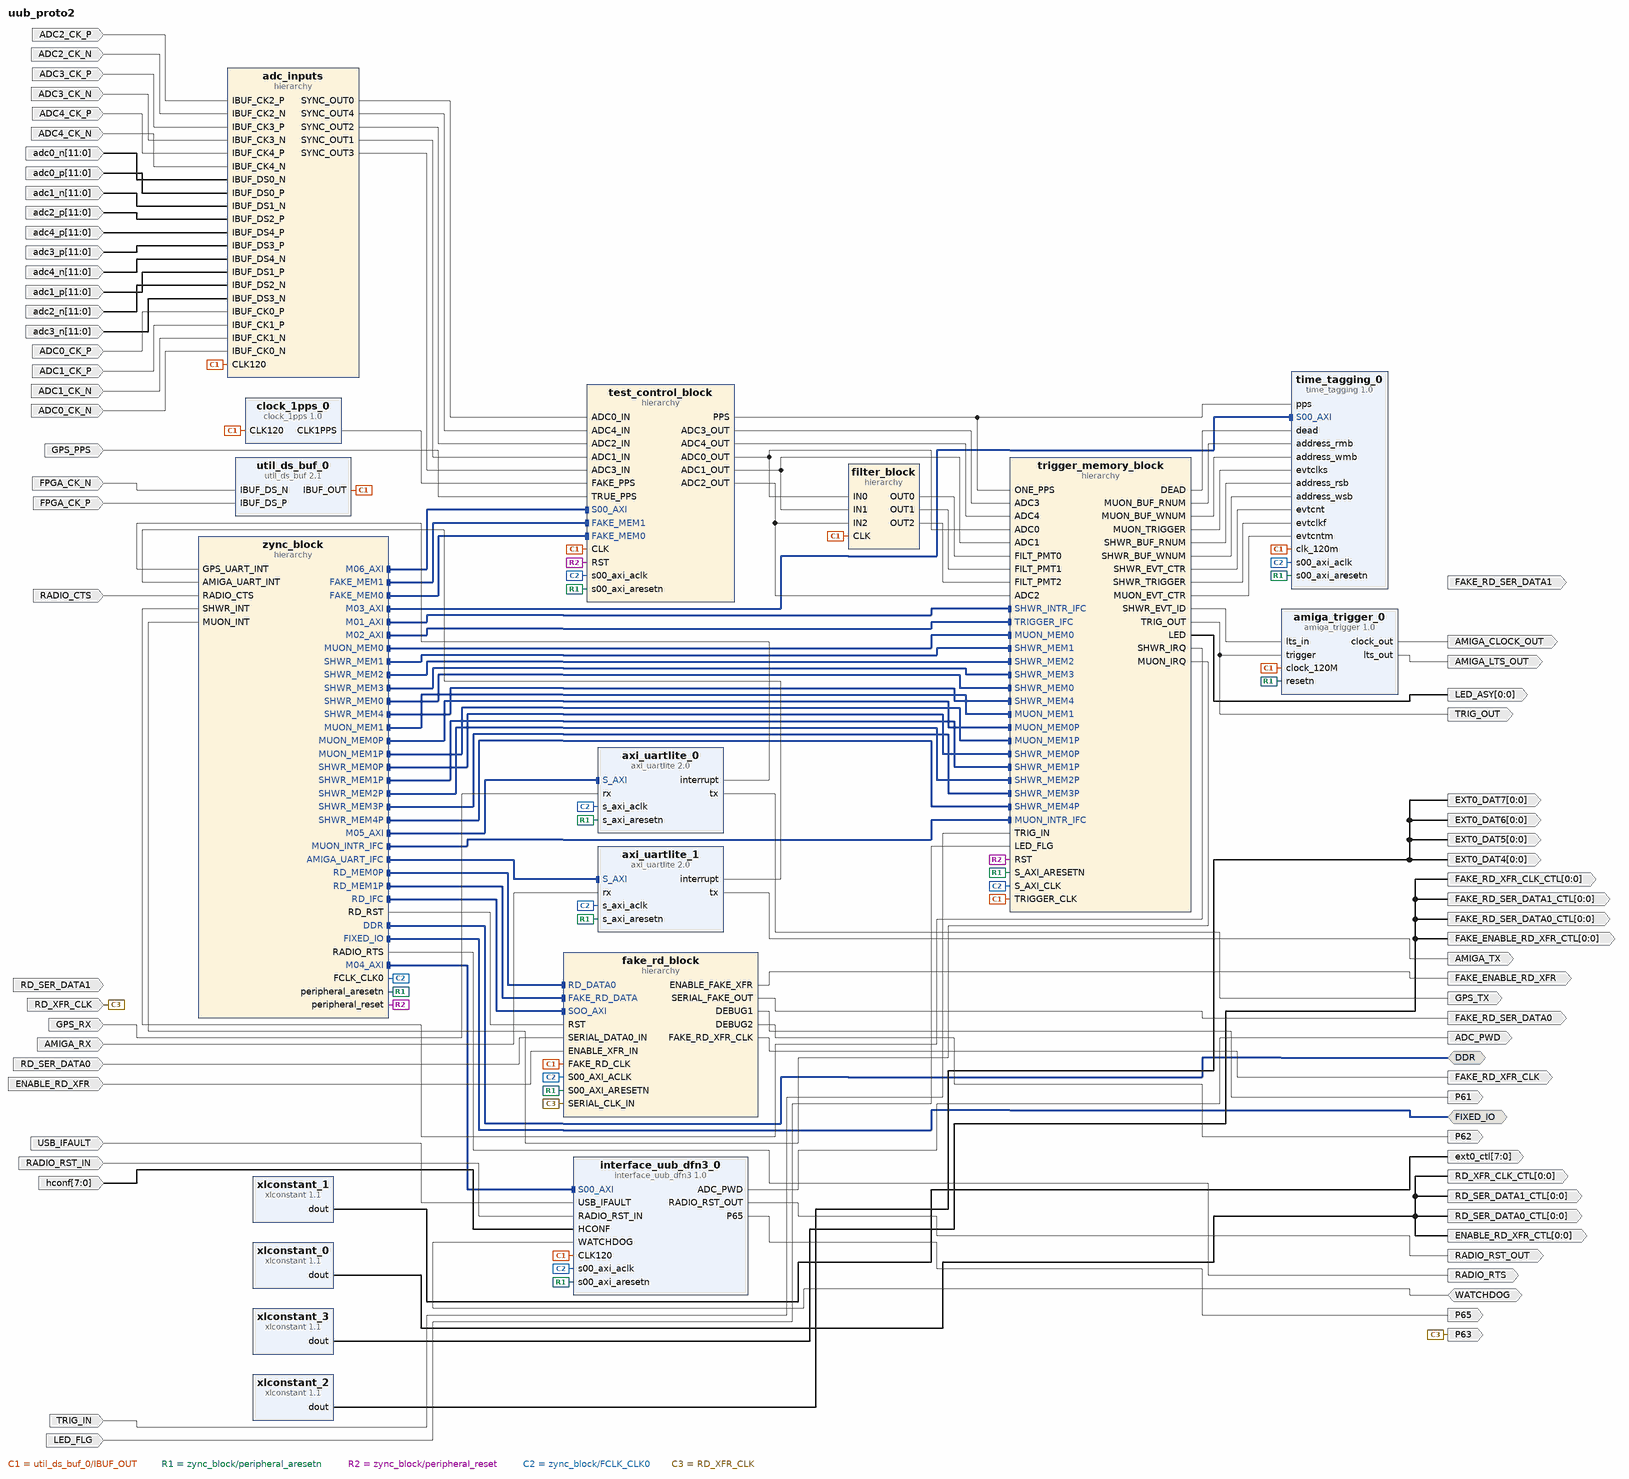
[diagram p0: block diagram of the top level]
# Vivado block design uub_proto2, Vivado 2015.2
create_bd_design uub_proto2

create_bd_intf_port -mode Master -vlnv xilinx.com:interface:ddrx_rtl:1.0 DDR
create_bd_intf_port -mode Master -vlnv xilinx.com:display_processing_system7:fixedio_rtl:1.0 FIXED_IO
create_bd_port -dir I RD_SER_DATA1
create_bd_port -dir O FAKE_RD_SER_DATA1
create_bd_port -dir I -type clk FPGA_CK_N
set_property -dict {CONFIG.FREQ_HZ 120000000} [get_bd_ports FPGA_CK_N]
create_bd_port -dir I -type clk FPGA_CK_P
set_property -dict {CONFIG.FREQ_HZ 120000000} [get_bd_ports FPGA_CK_P]
create_bd_port -dir I RADIO_CTS
create_bd_port -dir O GPS_TX
create_bd_port -dir I GPS_RX
create_bd_port -dir O RADIO_RTS
create_bd_port -dir I -type clk ADC2_CK_P
set_property -dict {CONFIG.FREQ_HZ 120000000} [get_bd_ports ADC2_CK_P]
create_bd_port -dir I -type clk ADC2_CK_N
set_property -dict {CONFIG.FREQ_HZ 120000000} [get_bd_ports ADC2_CK_N]
create_bd_port -dir I -type clk ADC3_CK_P
set_property -dict {CONFIG.FREQ_HZ 120000000} [get_bd_ports ADC3_CK_P]
create_bd_port -dir I -type clk ADC3_CK_N
set_property -dict {CONFIG.FREQ_HZ 120000000} [get_bd_ports ADC3_CK_N]
create_bd_port -dir I -type clk ADC4_CK_P
set_property -dict {CONFIG.FREQ_HZ 120000000} [get_bd_ports ADC4_CK_P]
create_bd_port -dir I -type clk ADC4_CK_N
set_property -dict {CONFIG.FREQ_HZ 120000000} [get_bd_ports ADC4_CK_N]
create_bd_port -dir I -from 11 -to 0 adc0_n
create_bd_port -dir I -from 11 -to 0 adc0_p
create_bd_port -dir I -from 11 -to 0 -type data adc1_n
create_bd_port -dir I -from 11 -to 0 -type data adc2_p
create_bd_port -dir I -from 11 -to 0 -type data adc4_p
create_bd_port -dir I -from 11 -to 0 -type data adc3_p
create_bd_port -dir I -from 11 -to 0 -type data adc4_n
create_bd_port -dir I -from 11 -to 0 -type data adc1_p
create_bd_port -dir I -from 11 -to 0 -type data adc2_n
create_bd_port -dir I -from 11 -to 0 -type data adc3_n
create_bd_port -dir I TRIG_IN
create_bd_port -dir I -type clk ADC0_CK_P
set_property -dict {CONFIG.FREQ_HZ 120000000} [get_bd_ports ADC0_CK_P]
create_bd_port -dir I -type clk ADC1_CK_P
set_property -dict {CONFIG.FREQ_HZ 120000000} [get_bd_ports ADC1_CK_P]
create_bd_port -dir I -type clk ADC1_CK_N
set_property -dict {CONFIG.FREQ_HZ 120000000} [get_bd_ports ADC1_CK_N]
create_bd_port -dir I -type clk ADC0_CK_N
set_property -dict {CONFIG.FREQ_HZ 120000000} [get_bd_ports ADC0_CK_N]
create_bd_port -dir I USB_IFAULT
create_bd_port -dir I RADIO_RST_IN
create_bd_port -dir I -from 7 -to 0 hconf
create_bd_port -dir O -from 0 -to 0 LED_ASY
create_bd_port -dir I LED_FLG
create_bd_port -dir O RADIO_RST_OUT
create_bd_port -dir I GPS_PPS
create_bd_port -dir O TRIG_OUT
create_bd_port -dir IO WATCHDOG
create_bd_port -dir O ADC_PWD
create_bd_port -dir O P65
create_bd_port -dir O -from 7 -to 0 ext0_ctl
create_bd_port -dir O AMIGA_CLOCK_OUT
create_bd_port -dir O AMIGA_LTS_OUT
create_bd_port -dir O AMIGA_TX
create_bd_port -dir I AMIGA_RX
create_bd_port -dir I RD_SER_DATA0
create_bd_port -dir I ENABLE_RD_XFR
create_bd_port -dir O FAKE_ENABLE_RD_XFR
create_bd_port -dir O -from 0 -to 0 ENABLE_RD_XFR_CTL
create_bd_port -dir O -from 0 -to 0 RD_SER_DATA1_CTL
create_bd_port -dir O -from 0 -to 0 RD_SER_DATA0_CTL
create_bd_port -dir O -from 0 -to 0 RD_XFR_CLK_CTL
create_bd_port -dir O -from 0 -to 0 FAKE_RD_XFR_CLK_CTL
create_bd_port -dir O -from 0 -to 0 FAKE_ENABLE_RD_XFR_CTL
create_bd_port -dir O -from 0 -to 0 FAKE_RD_SER_DATA0_CTL
create_bd_port -dir O -from 0 -to 0 FAKE_RD_SER_DATA1_CTL
create_bd_port -dir O FAKE_RD_SER_DATA0
create_bd_port -dir O -from 0 -to 0 EXT0_DAT7
create_bd_port -dir O -from 0 -to 0 EXT0_DAT6
create_bd_port -dir O -from 0 -to 0 EXT0_DAT4
create_bd_port -dir O -from 0 -to 0 EXT0_DAT5
create_bd_port -dir I -type clk RD_XFR_CLK
create_bd_port -dir O P63
create_bd_port -dir O P61
create_bd_port -dir O P62
create_bd_port -dir O FAKE_RD_XFR_CLK

create_bd_cell -type hier zync_block
create_bd_cell -type ip -vlnv xilinx.com:ip:axi_uartlite:2.0 axi_uartlite_0
create_bd_cell -type ip -vlnv auger.org:dfnitz:clock_1pps:1.0 clock_1pps_0
create_bd_cell -type ip -vlnv xilinx.com:ip:util_ds_buf:2.1 util_ds_buf_0
set_property -dict {CONFIG.C_BUF_TYPE IBUFDS} [get_bd_cells util_ds_buf_0]
create_bd_cell -type hier adc_inputs
create_bd_cell -type hier trigger_memory_block
create_bd_cell -type ip -vlnv xilinx.com:ip:xlconstant:1.1 xlconstant_0
set_property -dict {CONFIG.CONST_WIDTH 1 CONFIG.CONST_VAL 0} [get_bd_cells xlconstant_0]
create_bd_cell -type hier filter_block
create_bd_cell -type ip -vlnv xilinx.com:user:time_tagging:1.0 time_tagging_0
create_bd_cell -type ip -vlnv auger.org:auger:interface_uub_dfn3:1.0 interface_uub_dfn3_0
create_bd_cell -type ip -vlnv user.org:user:amiga_trigger:1.0 amiga_trigger_0
create_bd_cell -type ip -vlnv xilinx.com:ip:xlconstant:1.1 xlconstant_1
set_property -dict {CONFIG.CONST_WIDTH 8 CONFIG.CONST_VAL 251} [get_bd_cells xlconstant_1]
create_bd_cell -type ip -vlnv xilinx.com:ip:axi_uartlite:2.0 axi_uartlite_1
create_bd_cell -type ip -vlnv xilinx.com:ip:xlconstant:1.1 xlconstant_2
set_property -dict {CONFIG.CONST_WIDTH 1 CONFIG.CONST_VAL 0} [get_bd_cells xlconstant_2]
create_bd_cell -type hier test_control_block
create_bd_cell -type hier fake_rd_block
create_bd_cell -type ip -vlnv xilinx.com:ip:xlconstant:1.1 xlconstant_3
set_property -dict {CONFIG.CONST_WIDTH 1 CONFIG.CONST_VAL 1} [get_bd_cells xlconstant_3]

# ---- hierarchy /zync_block ----
current_bd_instance /zync_block
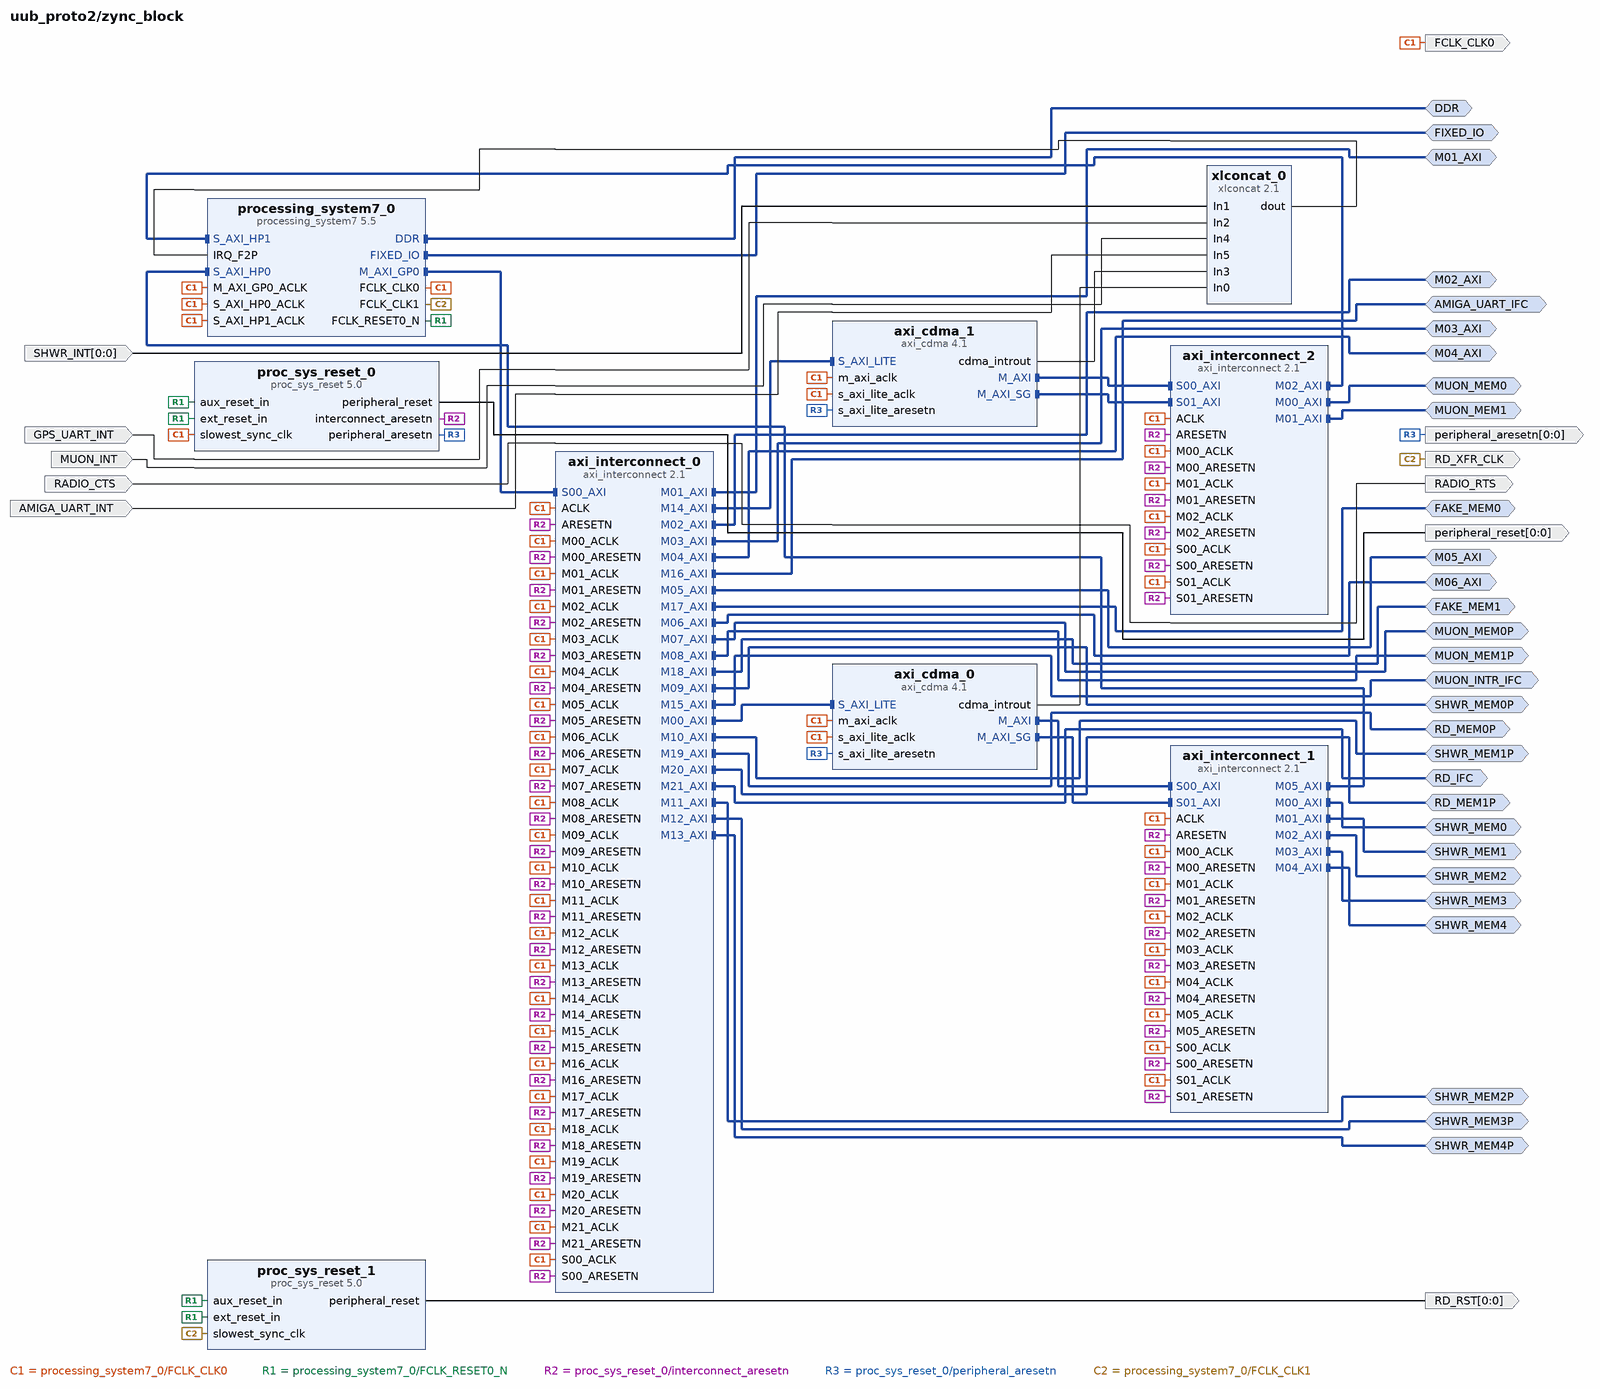
[diagram p1: block diagram inside /zync_block]
create_bd_intf_pin -mode Master -vlnv xilinx.com:interface:ddrx_rtl:1.0 DDR
create_bd_intf_pin -mode Master -vlnv xilinx.com:display_processing_system7:fixedio_rtl:1.0 FIXED_IO
create_bd_intf_pin -mode Master -vlnv xilinx.com:interface:aximm_rtl:1.0 M01_AXI
create_bd_intf_pin -mode Master -vlnv xilinx.com:interface:aximm_rtl:1.0 MUON_MEM0
create_bd_intf_pin -mode Master -vlnv xilinx.com:interface:aximm_rtl:1.0 M02_AXI
create_bd_intf_pin -mode Master -vlnv xilinx.com:interface:aximm_rtl:1.0 SHWR_MEM0
create_bd_intf_pin -mode Master -vlnv xilinx.com:interface:aximm_rtl:1.0 M03_AXI
create_bd_intf_pin -mode Master -vlnv xilinx.com:interface:aximm_rtl:1.0 SHWR_MEM1
create_bd_intf_pin -mode Master -vlnv xilinx.com:interface:aximm_rtl:1.0 M04_AXI
create_bd_intf_pin -mode Master -vlnv xilinx.com:interface:aximm_rtl:1.0 SHWR_MEM2
create_bd_intf_pin -mode Master -vlnv xilinx.com:interface:aximm_rtl:1.0 M05_AXI
create_bd_intf_pin -mode Master -vlnv xilinx.com:interface:aximm_rtl:1.0 SHWR_MEM3
create_bd_intf_pin -mode Master -vlnv xilinx.com:interface:aximm_rtl:1.0 M06_AXI
create_bd_intf_pin -mode Master -vlnv xilinx.com:interface:aximm_rtl:1.0 SHWR_MEM4
create_bd_intf_pin -mode Master -vlnv xilinx.com:interface:aximm_rtl:1.0 MUON_MEM1
create_bd_intf_pin -mode Master -vlnv xilinx.com:interface:aximm_rtl:1.0 MUON_MEM0P
create_bd_intf_pin -mode Master -vlnv xilinx.com:interface:aximm_rtl:1.0 MUON_MEM1P
create_bd_intf_pin -mode Master -vlnv xilinx.com:interface:aximm_rtl:1.0 SHWR_MEM0P
create_bd_intf_pin -mode Master -vlnv xilinx.com:interface:aximm_rtl:1.0 SHWR_MEM1P
create_bd_intf_pin -mode Master -vlnv xilinx.com:interface:aximm_rtl:1.0 SHWR_MEM2P
create_bd_intf_pin -mode Master -vlnv xilinx.com:interface:aximm_rtl:1.0 SHWR_MEM3P
create_bd_intf_pin -mode Master -vlnv xilinx.com:interface:aximm_rtl:1.0 SHWR_MEM4P
create_bd_intf_pin -mode Master -vlnv xilinx.com:interface:aximm_rtl:1.0 MUON_INTR_IFC
create_bd_intf_pin -mode Master -vlnv xilinx.com:interface:aximm_rtl:1.0 AMIGA_UART_IFC
create_bd_intf_pin -mode Master -vlnv xilinx.com:interface:aximm_rtl:1.0 FAKE_MEM0
create_bd_intf_pin -mode Master -vlnv xilinx.com:interface:aximm_rtl:1.0 FAKE_MEM1
create_bd_intf_pin -mode Master -vlnv xilinx.com:interface:aximm_rtl:1.0 RD_MEM0P
create_bd_intf_pin -mode Master -vlnv xilinx.com:interface:aximm_rtl:1.0 RD_MEM1P
create_bd_intf_pin -mode Master -vlnv xilinx.com:interface:aximm_rtl:1.0 RD_IFC
create_bd_pin -dir O -type clk FCLK_CLK0
create_bd_pin -dir I -from 0 -to 0 SHWR_INT
create_bd_pin -dir I RADIO_CTS
create_bd_pin -dir O RADIO_RTS
create_bd_pin -dir O -from 0 -to 0 -type rst peripheral_aresetn
create_bd_pin -dir O -from 0 -to 0 -type rst peripheral_reset
create_bd_pin -dir I GPS_UART_INT
create_bd_pin -dir I MUON_INT
create_bd_pin -dir I AMIGA_UART_INT
create_bd_pin -dir O RD_XFR_CLK
create_bd_pin -dir O -from 0 -to 0 RD_RST

create_bd_cell -type ip -vlnv xilinx.com:ip:axi_interconnect:2.1 axi_interconnect_1
set_property -dict {CONFIG.NUM_SI 2 CONFIG.NUM_MI 6 CONFIG.ENABLE_ADVANCED_OPTIONS 0} [get_bd_cells axi_interconnect_1]
create_bd_cell -type ip -vlnv xilinx.com:ip:proc_sys_reset:5.0 proc_sys_reset_0
create_bd_cell -type ip -vlnv xilinx.com:ip:xlconcat:2.1 xlconcat_0
set_property -dict {CONFIG.NUM_PORTS 6} [get_bd_cells xlconcat_0]
create_bd_cell -type ip -vlnv xilinx.com:ip:axi_cdma:4.1 axi_cdma_0
create_bd_cell -type ip -vlnv xilinx.com:ip:axi_interconnect:2.1 axi_interconnect_0
set_property -dict {CONFIG.NUM_MI 22} [get_bd_cells axi_interconnect_0]
create_bd_cell -type ip -vlnv xilinx.com:ip:axi_interconnect:2.1 axi_interconnect_2
set_property -dict {CONFIG.NUM_SI 2 CONFIG.NUM_MI 3 CONFIG.ENABLE_ADVANCED_OPTIONS 0} [get_bd_cells axi_interconnect_2]
create_bd_cell -type ip -vlnv xilinx.com:ip:axi_cdma:4.1 axi_cdma_1
create_bd_cell -type ip -vlnv xilinx.com:ip:processing_system7:5.5 processing_system7_0
set_property -dict [list \
  CONFIG.PCW_UIPARAM_DDR_FREQ_MHZ 400 \
  CONFIG.PCW_CRYSTAL_PERIPHERAL_FREQMHZ 50 \
  CONFIG.PCW_APU_PERIPHERAL_FREQMHZ 333.5 \
  CONFIG.PCW_QSPI_PERIPHERAL_FREQMHZ 60 \
  CONFIG.PCW_SPI_PERIPHERAL_FREQMHZ 100 \
  CONFIG.PCW_FPGA0_PERIPHERAL_FREQMHZ 50 \
  CONFIG.PCW_FPGA1_PERIPHERAL_FREQMHZ 30 \
  CONFIG.PCW_USE_S_AXI_HP0 1 \
  CONFIG.PCW_USE_S_AXI_HP1 1 \
  CONFIG.PCW_USE_FABRIC_INTERRUPT 1 \
  CONFIG.PCW_EN_CLK1_PORT 1 \
  CONFIG.PCW_IRQ_F2P_INTR 1 \
  CONFIG.PCW_PRESET_BANK1_VOLTAGE {LVCMOS 1.8V} \
  CONFIG.PCW_UIPARAM_DDR_MEMORY_TYPE {LPDDR 2} \
  CONFIG.PCW_UIPARAM_DDR_PARTNO Custom \
  CONFIG.PCW_QSPI_PERIPHERAL_ENABLE 1 \
  CONFIG.PCW_QSPI_GRP_SINGLE_SS_ENABLE 0 \
  CONFIG.PCW_QSPI_GRP_SS1_ENABLE 1 \
  CONFIG.PCW_ENET0_PERIPHERAL_ENABLE 1 \
  CONFIG.PCW_ENET0_ENET0_IO {MIO 16 .. 27} \
  CONFIG.PCW_ENET0_GRP_MDIO_ENABLE 1 \
  CONFIG.PCW_ENET0_RESET_ENABLE 1 \
  CONFIG.PCW_ENET0_RESET_IO {MIO 50} \
  CONFIG.PCW_UART0_PERIPHERAL_ENABLE 1 \
  CONFIG.PCW_UART0_UART0_IO {MIO 46 .. 47} \
  CONFIG.PCW_UART0_GRP_FULL_ENABLE 1 \
  CONFIG.PCW_UART1_PERIPHERAL_ENABLE 1 \
  CONFIG.PCW_UART1_UART1_IO {MIO 8 .. 9} \
  CONFIG.PCW_SPI0_PERIPHERAL_ENABLE 1 \
  CONFIG.PCW_SPI0_SPI0_IO {MIO 40 .. 45} \
  CONFIG.PCW_SPI0_GRP_SS1_ENABLE 1 \
  CONFIG.PCW_SPI0_GRP_SS2_ENABLE 1 \
  CONFIG.PCW_SPI1_PERIPHERAL_ENABLE 1 \
  CONFIG.PCW_SPI1_SPI1_IO {MIO 10 .. 15} \
  CONFIG.PCW_USB0_PERIPHERAL_ENABLE 1 \
  CONFIG.PCW_USB0_RESET_ENABLE 1 \
  CONFIG.PCW_USB0_RESET_IO {MIO 51} \
  CONFIG.PCW_I2C0_PERIPHERAL_ENABLE 1 \
  CONFIG.PCW_I2C0_I2C0_IO {MIO 14 .. 15} \
  CONFIG.PCW_I2C1_PERIPHERAL_ENABLE 1 \
  CONFIG.PCW_I2C1_I2C1_IO {MIO 48 .. 49} \
  CONFIG.PCW_GPIO_MIO_GPIO_ENABLE 1 \
  CONFIG.PCW_GPIO_MIO_GPIO_IO MIO \
] [get_bd_cells processing_system7_0]
# 23 more settings of processing_system7_0 are not shown: defaults, MIO pin electricals, DDR timing, and values the tool derives
create_bd_cell -type ip -vlnv xilinx.com:ip:proc_sys_reset:5.0 proc_sys_reset_1

# ---- hierarchy /adc_inputs ----
current_bd_instance /adc_inputs
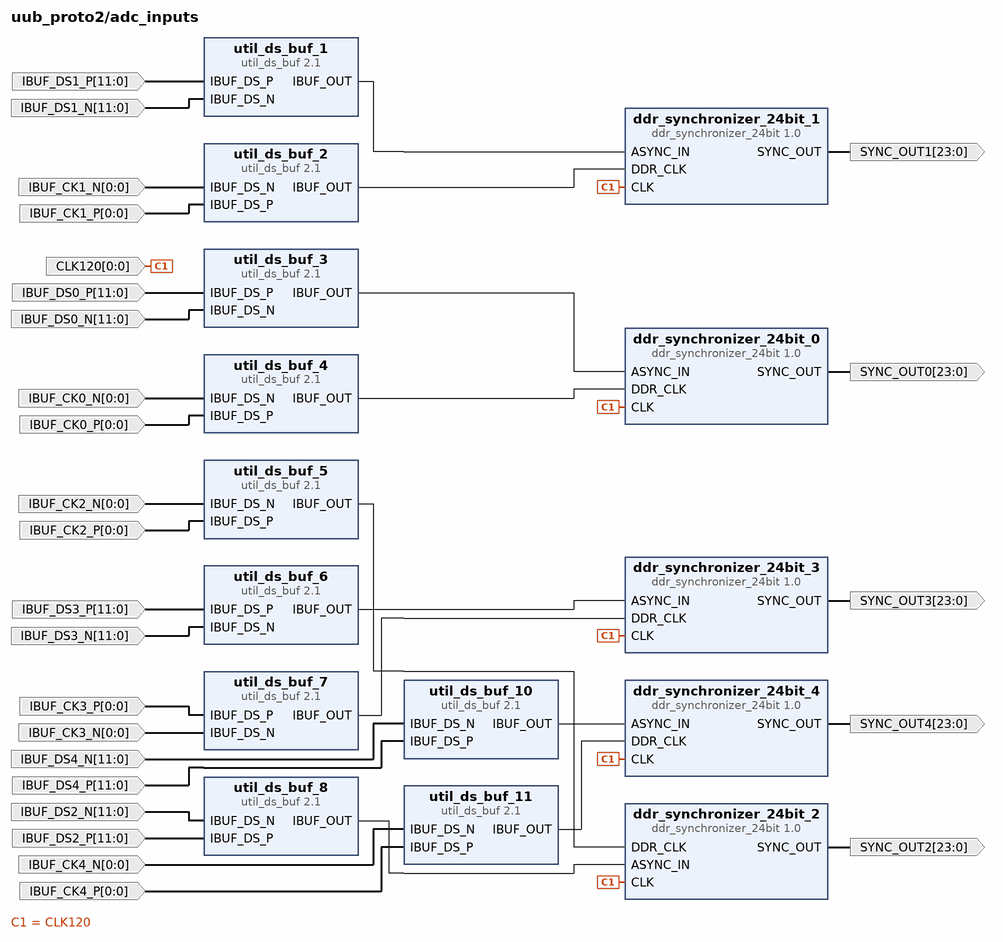
[diagram p2: block diagram inside /adc_inputs]
create_bd_pin -dir I -from 0 -to 0 -type clk CLK120
create_bd_pin -dir I -from 11 -to 0 IBUF_DS2_N
create_bd_pin -dir I -from 11 -to 0 IBUF_DS1_P
create_bd_pin -dir I -from 11 -to 0 IBUF_DS4_N
create_bd_pin -dir I -from 11 -to 0 IBUF_DS3_P
create_bd_pin -dir I -from 11 -to 0 IBUF_DS0_P
create_bd_pin -dir I -from 0 -to 0 IBUF_CK4_N
create_bd_pin -dir I -from 0 -to 0 IBUF_CK3_P
create_bd_pin -dir I -from 0 -to 0 IBUF_CK2_N
create_bd_pin -dir I -from 0 -to 0 IBUF_CK2_P
create_bd_pin -dir O -from 23 -to 0 SYNC_OUT0
create_bd_pin -dir I -from 0 -to 0 IBUF_CK1_N
create_bd_pin -dir I -from 0 -to 0 IBUF_CK4_P
create_bd_pin -dir O -from 23 -to 0 SYNC_OUT3
create_bd_pin -dir I -from 11 -to 0 IBUF_DS3_N
create_bd_pin -dir O -from 23 -to 0 SYNC_OUT1
create_bd_pin -dir I -from 11 -to 0 IBUF_DS0_N
create_bd_pin -dir I -from 0 -to 0 IBUF_CK3_N
create_bd_pin -dir O -from 23 -to 0 SYNC_OUT2
create_bd_pin -dir O -from 23 -to 0 SYNC_OUT4
create_bd_pin -dir I -from 11 -to 0 IBUF_DS2_P
create_bd_pin -dir I -from 0 -to 0 IBUF_CK0_N
create_bd_pin -dir I -from 11 -to 0 IBUF_DS1_N
create_bd_pin -dir I -from 0 -to 0 IBUF_CK1_P
create_bd_pin -dir I -from 0 -to 0 IBUF_CK0_P
create_bd_pin -dir I -from 11 -to 0 IBUF_DS4_P

create_bd_cell -type ip -vlnv xilinx.com:ip:util_ds_buf:2.1 util_ds_buf_5
create_bd_cell -type ip -vlnv xilinx.com:ip:util_ds_buf:2.1 util_ds_buf_7
create_bd_cell -type ip -vlnv xilinx.com:ip:util_ds_buf:2.1 util_ds_buf_11
create_bd_cell -type ip -vlnv xilinx.com:ip:util_ds_buf:2.1 util_ds_buf_8
set_property -dict {CONFIG.C_SIZE 12} [get_bd_cells util_ds_buf_8]
create_bd_cell -type ip -vlnv xilinx.com:ip:util_ds_buf:2.1 util_ds_buf_6
set_property -dict {CONFIG.C_SIZE 12} [get_bd_cells util_ds_buf_6]
create_bd_cell -type ip -vlnv xilinx.com:ip:util_ds_buf:2.1 util_ds_buf_10
set_property -dict {CONFIG.C_SIZE 12} [get_bd_cells util_ds_buf_10]
create_bd_cell -type ip -vlnv xilinx.com:ip:util_ds_buf:2.1 util_ds_buf_2
create_bd_cell -type ip -vlnv xilinx.com:ip:util_ds_buf:2.1 util_ds_buf_4
create_bd_cell -type ip -vlnv xilinx.com:ip:util_ds_buf:2.1 util_ds_buf_1
set_property -dict {CONFIG.C_SIZE 12} [get_bd_cells util_ds_buf_1]
create_bd_cell -type ip -vlnv xilinx.com:ip:util_ds_buf:2.1 util_ds_buf_3
set_property -dict {CONFIG.C_SIZE 12} [get_bd_cells util_ds_buf_3]
create_bd_cell -type ip -vlnv auger.org:auger:ddr_synchronizer_24bit:1.0 ddr_synchronizer_24bit_0
create_bd_cell -type ip -vlnv auger.org:auger:ddr_synchronizer_24bit:1.0 ddr_synchronizer_24bit_1
create_bd_cell -type ip -vlnv auger.org:auger:ddr_synchronizer_24bit:1.0 ddr_synchronizer_24bit_2
create_bd_cell -type ip -vlnv auger.org:auger:ddr_synchronizer_24bit:1.0 ddr_synchronizer_24bit_3
create_bd_cell -type ip -vlnv auger.org:auger:ddr_synchronizer_24bit:1.0 ddr_synchronizer_24bit_4

# ---- hierarchy /trigger_memory_block ----
current_bd_instance /trigger_memory_block
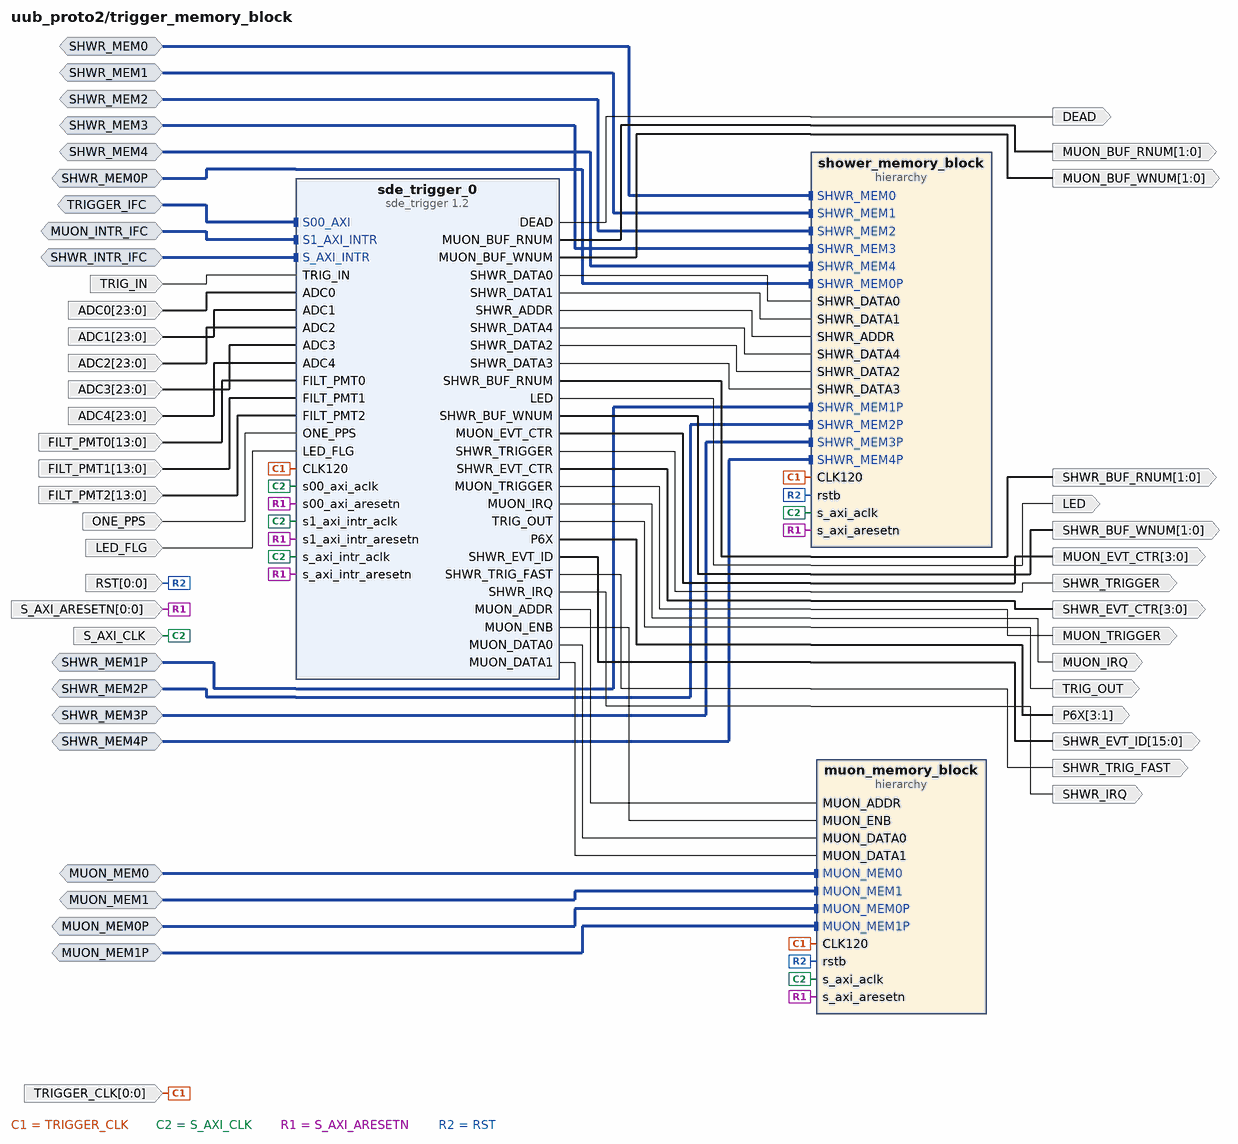
[diagram p3: block diagram inside /trigger_memory_block]
create_bd_intf_pin -mode Slave -vlnv xilinx.com:interface:aximm_rtl:1.0 MUON_MEM0
create_bd_intf_pin -mode Slave -vlnv xilinx.com:interface:aximm_rtl:1.0 SHWR_MEM0
create_bd_intf_pin -mode Slave -vlnv xilinx.com:interface:aximm_rtl:1.0 SHWR_MEM1
create_bd_intf_pin -mode Slave -vlnv xilinx.com:interface:aximm_rtl:1.0 SHWR_MEM2
create_bd_intf_pin -mode Slave -vlnv xilinx.com:interface:aximm_rtl:1.0 SHWR_MEM3
create_bd_intf_pin -mode Slave -vlnv xilinx.com:interface:aximm_rtl:1.0 TRIGGER_IFC
create_bd_intf_pin -mode Slave -vlnv xilinx.com:interface:aximm_rtl:1.0 SHWR_MEM4
create_bd_intf_pin -mode Slave -vlnv xilinx.com:interface:aximm_rtl:1.0 MUON_MEM1
create_bd_intf_pin -mode Slave -vlnv xilinx.com:interface:aximm_rtl:1.0 MUON_MEM0P
create_bd_intf_pin -mode Slave -vlnv xilinx.com:interface:aximm_rtl:1.0 MUON_MEM1P
create_bd_intf_pin -mode Slave -vlnv xilinx.com:interface:aximm_rtl:1.0 SHWR_MEM0P
create_bd_intf_pin -mode Slave -vlnv xilinx.com:interface:aximm_rtl:1.0 SHWR_MEM1P
create_bd_intf_pin -mode Slave -vlnv xilinx.com:interface:aximm_rtl:1.0 SHWR_MEM2P
create_bd_intf_pin -mode Slave -vlnv xilinx.com:interface:aximm_rtl:1.0 SHWR_MEM3P
create_bd_intf_pin -mode Slave -vlnv xilinx.com:interface:aximm_rtl:1.0 SHWR_MEM4P
create_bd_intf_pin -mode Slave -vlnv xilinx.com:interface:aximm_rtl:1.0 MUON_INTR_IFC
create_bd_intf_pin -mode Slave -vlnv xilinx.com:interface:aximm_rtl:1.0 SHWR_INTR_IFC
create_bd_pin -dir I -type clk S_AXI_CLK
create_bd_pin -dir I -from 0 -to 0 -type rst RST
create_bd_pin -dir O -type data DEAD
create_bd_pin -dir I -from 0 -to 0 -type rst S_AXI_ARESETN
create_bd_pin -dir I -from 0 -to 0 TRIGGER_CLK
create_bd_pin -dir O -from 1 -to 0 -type data MUON_BUF_RNUM
create_bd_pin -dir O -from 1 -to 0 -type data MUON_BUF_WNUM
create_bd_pin -dir O -type data MUON_TRIGGER
create_bd_pin -dir O -from 1 -to 0 -type data SHWR_BUF_RNUM
create_bd_pin -dir O -from 1 -to 0 -type data SHWR_BUF_WNUM
create_bd_pin -dir O -from 3 -to 0 -type data SHWR_EVT_CTR
create_bd_pin -dir O -type data SHWR_TRIGGER
create_bd_pin -dir I TRIG_IN
create_bd_pin -dir O -from 3 -to 0 MUON_EVT_CTR
create_bd_pin -dir O TRIG_OUT
create_bd_pin -dir I -from 23 -to 0 ADC0
create_bd_pin -dir I -from 23 -to 0 ADC1
create_bd_pin -dir I -from 23 -to 0 ADC2
create_bd_pin -dir I -from 23 -to 0 ADC3
create_bd_pin -dir I -from 23 -to 0 ADC4
create_bd_pin -dir I -from 13 -to 0 FILT_PMT0
create_bd_pin -dir I -from 13 -to 0 FILT_PMT1
create_bd_pin -dir I -from 13 -to 0 FILT_PMT2
create_bd_pin -dir I ONE_PPS
create_bd_pin -dir I LED_FLG
create_bd_pin -dir O LED
create_bd_pin -dir O -from 15 -to 0 SHWR_EVT_ID
create_bd_pin -dir O SHWR_TRIG_FAST
create_bd_pin -dir O -from 3 -to 1 P6X
create_bd_pin -dir O MUON_IRQ
create_bd_pin -dir O SHWR_IRQ

create_bd_cell -type hier muon_memory_block
create_bd_cell -type hier shower_memory_block
create_bd_cell -type ip -vlnv auger.mtu.edu:user:sde_trigger:1.2 sde_trigger_0

# ---- hierarchy /trigger_memory_block/muon_memory_block ----
current_bd_instance /trigger_memory_block/muon_memory_block
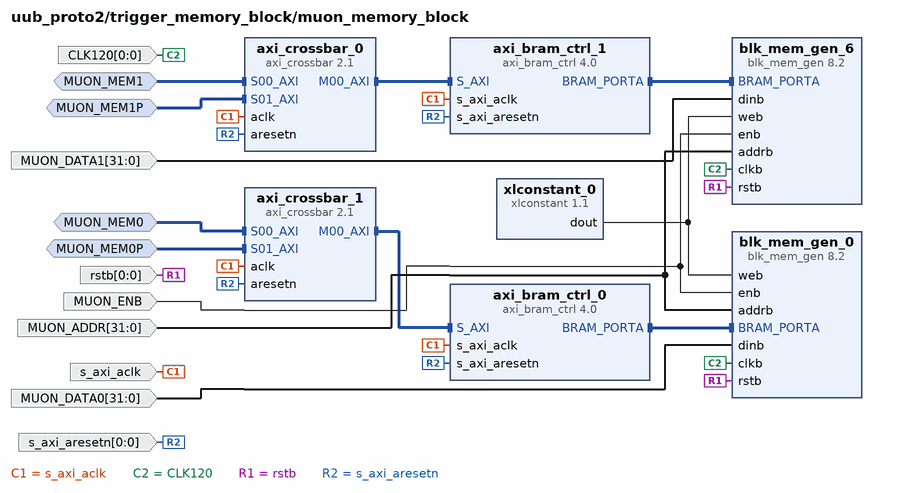
[diagram p4: block diagram inside /trigger_memory_block/muon_memory_block]
create_bd_intf_pin -mode Slave -vlnv xilinx.com:interface:aximm_rtl:1.0 MUON_MEM0
create_bd_intf_pin -mode Slave -vlnv xilinx.com:interface:aximm_rtl:1.0 MUON_MEM1
create_bd_intf_pin -mode Slave -vlnv xilinx.com:interface:aximm_rtl:1.0 MUON_MEM0P
create_bd_intf_pin -mode Slave -vlnv xilinx.com:interface:aximm_rtl:1.0 MUON_MEM1P
create_bd_pin -dir I -type clk s_axi_aclk
create_bd_pin -dir I -from 0 -to 0 CLK120
create_bd_pin -dir I MUON_ENB
create_bd_pin -dir I -from 31 -to 0 MUON_ADDR
create_bd_pin -dir I -from 0 -to 0 -type rst s_axi_aresetn
create_bd_pin -dir I -from 31 -to 0 MUON_DATA1
create_bd_pin -dir I -from 31 -to 0 MUON_DATA0
create_bd_pin -dir I -from 0 -to 0 rstb

create_bd_cell -type ip -vlnv xilinx.com:ip:axi_bram_ctrl:4.0 axi_bram_ctrl_0
set_property -dict {CONFIG.SINGLE_PORT_BRAM 1} [get_bd_cells axi_bram_ctrl_0]
create_bd_cell -type ip -vlnv xilinx.com:ip:axi_bram_ctrl:4.0 axi_bram_ctrl_1
set_property -dict {CONFIG.SINGLE_PORT_BRAM 1} [get_bd_cells axi_bram_ctrl_1]
create_bd_cell -type ip -vlnv xilinx.com:ip:blk_mem_gen:8.2 blk_mem_gen_0
set_property -dict [list \
  CONFIG.Memory_Type True_Dual_Port_RAM \
  CONFIG.Enable_B Use_ENB_Pin \
  CONFIG.Use_RSTB_Pin true \
  CONFIG.Port_B_Clock 100 \
  CONFIG.Port_B_Write_Rate 50 \
  CONFIG.Port_B_Enable_Rate 100 \
] [get_bd_cells blk_mem_gen_0]
create_bd_cell -type ip -vlnv xilinx.com:ip:blk_mem_gen:8.2 blk_mem_gen_6
set_property -dict [list \
  CONFIG.Memory_Type True_Dual_Port_RAM \
  CONFIG.Enable_B Use_ENB_Pin \
  CONFIG.Use_RSTB_Pin true \
  CONFIG.Port_B_Clock 100 \
  CONFIG.Port_B_Write_Rate 50 \
  CONFIG.Port_B_Enable_Rate 100 \
] [get_bd_cells blk_mem_gen_6]
create_bd_cell -type ip -vlnv xilinx.com:ip:xlconstant:1.1 xlconstant_0
set_property -dict {CONFIG.CONST_WIDTH 4 CONFIG.CONST_VAL 15} [get_bd_cells xlconstant_0]
create_bd_cell -type ip -vlnv xilinx.com:ip:axi_crossbar:2.1 axi_crossbar_0
set_property -dict {CONFIG.NUM_SI 2 CONFIG.NUM_MI 1 CONFIG.DATA_WIDTH 32} [get_bd_cells axi_crossbar_0]
create_bd_cell -type ip -vlnv xilinx.com:ip:axi_crossbar:2.1 axi_crossbar_1
set_property -dict {CONFIG.NUM_SI 2 CONFIG.NUM_MI 1 CONFIG.DATA_WIDTH 32} [get_bd_cells axi_crossbar_1]

# ---- hierarchy /trigger_memory_block/shower_memory_block ----
current_bd_instance /trigger_memory_block/shower_memory_block
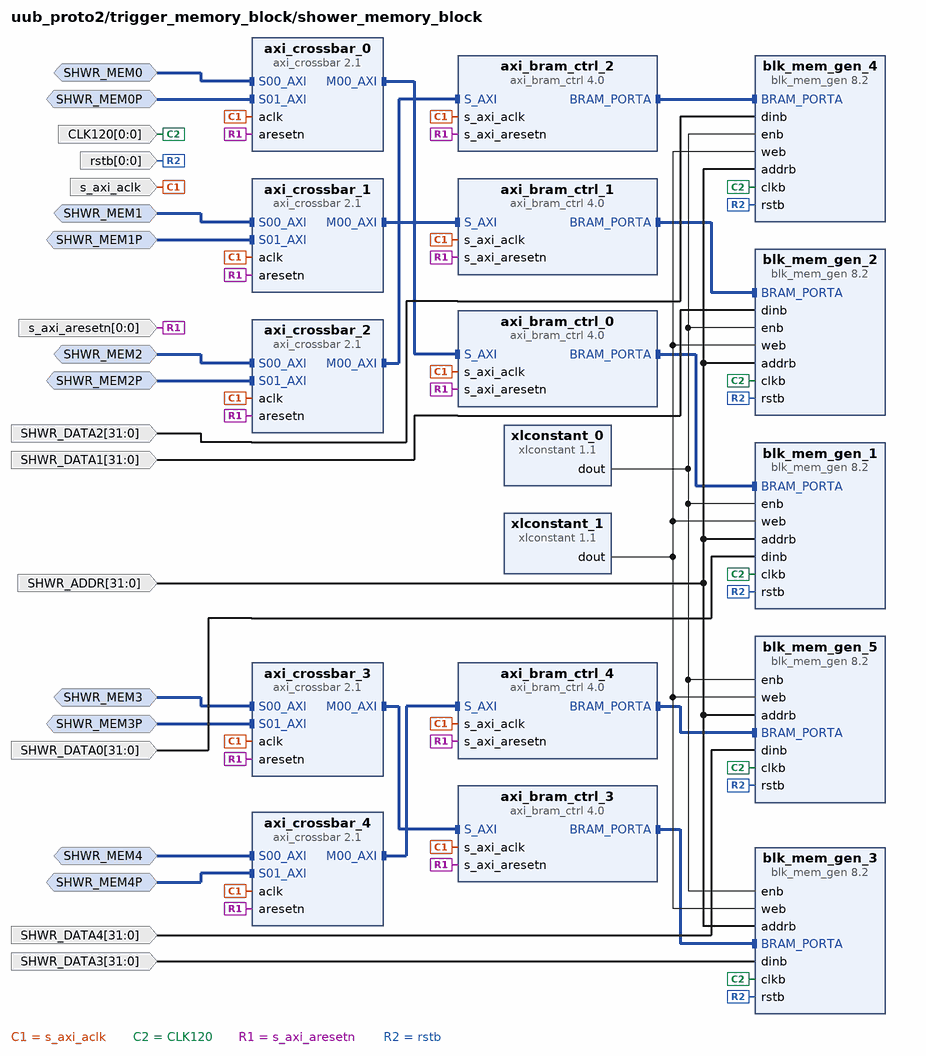
[diagram p5: block diagram inside /trigger_memory_block/shower_memory_block]
create_bd_intf_pin -mode Slave -vlnv xilinx.com:interface:aximm_rtl:1.0 SHWR_MEM0
create_bd_intf_pin -mode Slave -vlnv xilinx.com:interface:aximm_rtl:1.0 SHWR_MEM1
create_bd_intf_pin -mode Slave -vlnv xilinx.com:interface:aximm_rtl:1.0 SHWR_MEM2
create_bd_intf_pin -mode Slave -vlnv xilinx.com:interface:aximm_rtl:1.0 SHWR_MEM3
create_bd_intf_pin -mode Slave -vlnv xilinx.com:interface:aximm_rtl:1.0 SHWR_MEM4
create_bd_intf_pin -mode Slave -vlnv xilinx.com:interface:aximm_rtl:1.0 SHWR_MEM0P
create_bd_intf_pin -mode Slave -vlnv xilinx.com:interface:aximm_rtl:1.0 SHWR_MEM1P
create_bd_intf_pin -mode Slave -vlnv xilinx.com:interface:aximm_rtl:1.0 SHWR_MEM2P
create_bd_intf_pin -mode Slave -vlnv xilinx.com:interface:aximm_rtl:1.0 SHWR_MEM3P
create_bd_intf_pin -mode Slave -vlnv xilinx.com:interface:aximm_rtl:1.0 SHWR_MEM4P
create_bd_pin -dir I -type clk s_axi_aclk
create_bd_pin -dir I -from 0 -to 0 CLK120
create_bd_pin -dir I -from 31 -to 0 SHWR_DATA1
create_bd_pin -dir I -from 31 -to 0 SHWR_DATA0
create_bd_pin -dir I -from 31 -to 0 SHWR_ADDR
create_bd_pin -dir I -from 31 -to 0 SHWR_DATA2
create_bd_pin -dir I -from 31 -to 0 SHWR_DATA3
create_bd_pin -dir I -from 0 -to 0 -type rst s_axi_aresetn
create_bd_pin -dir I -from 0 -to 0 rstb
create_bd_pin -dir I -from 31 -to 0 SHWR_DATA4

create_bd_cell -type ip -vlnv xilinx.com:ip:blk_mem_gen:8.2 blk_mem_gen_5
set_property -dict [list \
  CONFIG.Memory_Type True_Dual_Port_RAM \
  CONFIG.Enable_B Use_ENB_Pin \
  CONFIG.Use_RSTB_Pin true \
  CONFIG.Port_B_Clock 100 \
  CONFIG.Port_B_Write_Rate 50 \
  CONFIG.Port_B_Enable_Rate 100 \
] [get_bd_cells blk_mem_gen_5]
create_bd_cell -type ip -vlnv xilinx.com:ip:axi_bram_ctrl:4.0 axi_bram_ctrl_0
set_property -dict {CONFIG.SINGLE_PORT_BRAM 1} [get_bd_cells axi_bram_ctrl_0]
create_bd_cell -type ip -vlnv xilinx.com:ip:axi_bram_ctrl:4.0 axi_bram_ctrl_1
set_property -dict {CONFIG.SINGLE_PORT_BRAM 1} [get_bd_cells axi_bram_ctrl_1]
create_bd_cell -type ip -vlnv xilinx.com:ip:axi_bram_ctrl:4.0 axi_bram_ctrl_2
set_property -dict {CONFIG.SINGLE_PORT_BRAM 1} [get_bd_cells axi_bram_ctrl_2]
create_bd_cell -type ip -vlnv xilinx.com:ip:xlconstant:1.1 xlconstant_0
create_bd_cell -type ip -vlnv xilinx.com:ip:xlconstant:1.1 xlconstant_1
set_property -dict {CONFIG.CONST_WIDTH 4 CONFIG.CONST_VAL 15} [get_bd_cells xlconstant_1]
create_bd_cell -type ip -vlnv xilinx.com:ip:axi_bram_ctrl:4.0 axi_bram_ctrl_3
set_property -dict {CONFIG.SINGLE_PORT_BRAM 1} [get_bd_cells axi_bram_ctrl_3]
create_bd_cell -type ip -vlnv xilinx.com:ip:axi_bram_ctrl:4.0 axi_bram_ctrl_4
set_property -dict {CONFIG.SINGLE_PORT_BRAM 1} [get_bd_cells axi_bram_ctrl_4]
create_bd_cell -type ip -vlnv xilinx.com:ip:blk_mem_gen:8.2 blk_mem_gen_1
set_property -dict [list \
  CONFIG.Memory_Type True_Dual_Port_RAM \
  CONFIG.Enable_B Use_ENB_Pin \
  CONFIG.Use_RSTB_Pin true \
  CONFIG.Port_B_Clock 100 \
  CONFIG.Port_B_Write_Rate 50 \
  CONFIG.Port_B_Enable_Rate 100 \
] [get_bd_cells blk_mem_gen_1]
create_bd_cell -type ip -vlnv xilinx.com:ip:blk_mem_gen:8.2 blk_mem_gen_2
set_property -dict [list \
  CONFIG.Memory_Type True_Dual_Port_RAM \
  CONFIG.Enable_B Use_ENB_Pin \
  CONFIG.Use_RSTB_Pin true \
  CONFIG.Port_B_Clock 100 \
  CONFIG.Port_B_Write_Rate 50 \
  CONFIG.Port_B_Enable_Rate 100 \
] [get_bd_cells blk_mem_gen_2]
create_bd_cell -type ip -vlnv xilinx.com:ip:blk_mem_gen:8.2 blk_mem_gen_3
set_property -dict [list \
  CONFIG.Memory_Type True_Dual_Port_RAM \
  CONFIG.Enable_B Use_ENB_Pin \
  CONFIG.Use_RSTB_Pin true \
  CONFIG.Port_B_Clock 100 \
  CONFIG.Port_B_Write_Rate 50 \
  CONFIG.Port_B_Enable_Rate 100 \
] [get_bd_cells blk_mem_gen_3]
create_bd_cell -type ip -vlnv xilinx.com:ip:blk_mem_gen:8.2 blk_mem_gen_4
set_property -dict [list \
  CONFIG.Memory_Type True_Dual_Port_RAM \
  CONFIG.Enable_B Use_ENB_Pin \
  CONFIG.Use_RSTB_Pin true \
  CONFIG.Port_B_Clock 100 \
  CONFIG.Port_B_Write_Rate 50 \
  CONFIG.Port_B_Enable_Rate 100 \
] [get_bd_cells blk_mem_gen_4]
create_bd_cell -type ip -vlnv xilinx.com:ip:axi_crossbar:2.1 axi_crossbar_0
set_property -dict {CONFIG.NUM_SI 2 CONFIG.NUM_MI 1 CONFIG.DATA_WIDTH 32} [get_bd_cells axi_crossbar_0]
create_bd_cell -type ip -vlnv xilinx.com:ip:axi_crossbar:2.1 axi_crossbar_1
set_property -dict {CONFIG.NUM_SI 2 CONFIG.NUM_MI 1 CONFIG.DATA_WIDTH 32} [get_bd_cells axi_crossbar_1]
create_bd_cell -type ip -vlnv xilinx.com:ip:axi_crossbar:2.1 axi_crossbar_2
set_property -dict {CONFIG.NUM_SI 2 CONFIG.NUM_MI 1 CONFIG.DATA_WIDTH 32} [get_bd_cells axi_crossbar_2]
create_bd_cell -type ip -vlnv xilinx.com:ip:axi_crossbar:2.1 axi_crossbar_3
set_property -dict {CONFIG.NUM_SI 2 CONFIG.NUM_MI 1 CONFIG.DATA_WIDTH 32} [get_bd_cells axi_crossbar_3]
create_bd_cell -type ip -vlnv xilinx.com:ip:axi_crossbar:2.1 axi_crossbar_4
set_property -dict {CONFIG.NUM_SI 2 CONFIG.NUM_MI 1 CONFIG.DATA_WIDTH 32} [get_bd_cells axi_crossbar_4]

# ---- hierarchy /filter_block ----
current_bd_instance /filter_block
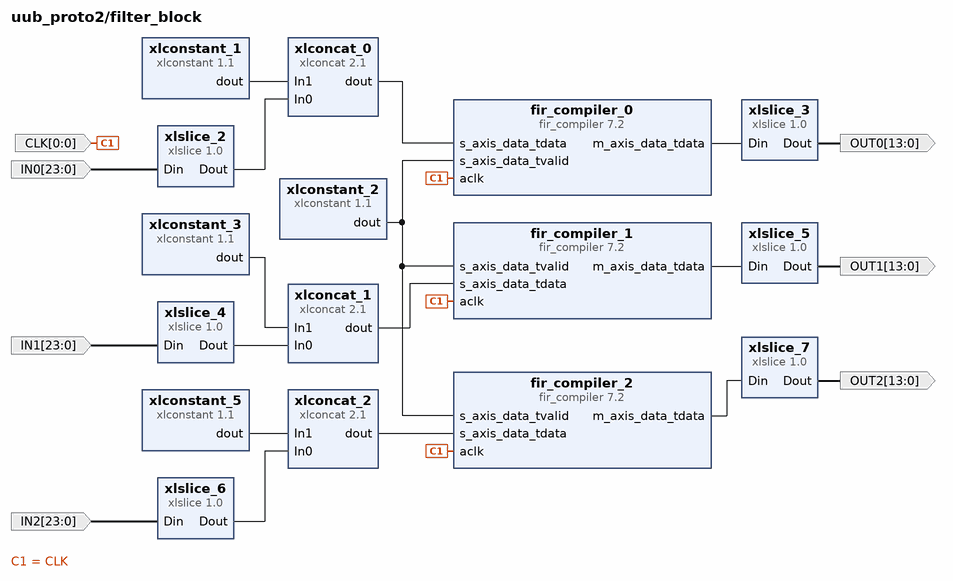
[diagram p6: block diagram inside /filter_block]
create_bd_pin -dir I -from 23 -to 0 IN0
create_bd_pin -dir O -from 13 -to 0 OUT0
create_bd_pin -dir I -from 23 -to 0 IN1
create_bd_pin -dir O -from 13 -to 0 OUT1
create_bd_pin -dir I -from 23 -to 0 IN2
create_bd_pin -dir O -from 13 -to 0 OUT2
create_bd_pin -dir I -from 0 -to 0 CLK

create_bd_cell -type ip -vlnv xilinx.com:ip:fir_compiler:7.2 fir_compiler_0
set_property -dict [list \
  CONFIG.CoefficientVector 5,0,12,22,0,-61,-96,0,256,551,681,551,256,0,-96,-61,0,22,12,0,5 \
  CONFIG.Coefficient_Sets 1 \
  CONFIG.Channel_Sequence Basic \
  CONFIG.Number_Channels 1 \
  CONFIG.Select_Pattern All \
  CONFIG.RateSpecification Input_Sample_Period \
  CONFIG.SamplePeriod 1 \
  CONFIG.Coefficient_Sign Signed \
  CONFIG.Quantization Integer_Coefficients \
  CONFIG.Coefficient_Width 11 \
  CONFIG.Coefficient_Fractional_Bits 0 \
  CONFIG.Coefficient_Structure Inferred \
  CONFIG.Data_Sign Unsigned \
  CONFIG.Data_Width 12 \
  CONFIG.Data_Fractional_Bits 0 \
  CONFIG.Output_Rounding_Mode Convergent_Rounding_to_Even \
  CONFIG.Output_Width 24 \
  CONFIG.Filter_Architecture Systolic_Multiply_Accumulate \
  CONFIG.ColumnConfig 11 \
  CONFIG.DATA_Has_TLAST Not_Required \
  CONFIG.S_DATA_Has_TUSER Not_Required \
  CONFIG.M_DATA_Has_TUSER Not_Required \
] [get_bd_cells fir_compiler_0]
create_bd_cell -type ip -vlnv xilinx.com:ip:xlconcat:2.1 xlconcat_0
set_property -dict {CONFIG.IN0_WIDTH 12 CONFIG.IN1_WIDTH 4} [get_bd_cells xlconcat_0]
create_bd_cell -type ip -vlnv xilinx.com:ip:xlconstant:1.1 xlconstant_1
set_property -dict {CONFIG.CONST_WIDTH 4 CONFIG.CONST_VAL 0} [get_bd_cells xlconstant_1]
create_bd_cell -type ip -vlnv xilinx.com:ip:xlconstant:1.1 xlconstant_2
create_bd_cell -type ip -vlnv xilinx.com:ip:xlslice:1.0 xlslice_2
set_property -dict {CONFIG.DOUT_WIDTH 12 CONFIG.DIN_TO 12 CONFIG.DIN_FROM 23 CONFIG.DIN_WIDTH 24} [get_bd_cells xlslice_2]
create_bd_cell -type ip -vlnv xilinx.com:ip:xlslice:1.0 xlslice_3
set_property -dict {CONFIG.DOUT_WIDTH 14 CONFIG.DIN_TO 10 CONFIG.DIN_FROM 23 CONFIG.DIN_WIDTH 24} [get_bd_cells xlslice_3]
create_bd_cell -type ip -vlnv xilinx.com:ip:fir_compiler:7.2 fir_compiler_1
set_property -dict [list \
  CONFIG.CoefficientVector 5,0,12,22,0,-61,-96,0,256,551,681,551,256,0,-96,-61,0,22,12,0,5 \
  CONFIG.Coefficient_Sets 1 \
  CONFIG.Channel_Sequence Basic \
  CONFIG.Number_Channels 1 \
  CONFIG.Select_Pattern All \
  CONFIG.RateSpecification Input_Sample_Period \
  CONFIG.SamplePeriod 1 \
  CONFIG.Coefficient_Sign Signed \
  CONFIG.Quantization Integer_Coefficients \
  CONFIG.Coefficient_Width 11 \
  CONFIG.Coefficient_Fractional_Bits 0 \
  CONFIG.Coefficient_Structure Inferred \
  CONFIG.Data_Sign Unsigned \
  CONFIG.Data_Width 12 \
  CONFIG.Data_Fractional_Bits 0 \
  CONFIG.Output_Rounding_Mode Convergent_Rounding_to_Even \
  CONFIG.Output_Width 24 \
  CONFIG.Filter_Architecture Systolic_Multiply_Accumulate \
  CONFIG.ColumnConfig 11 \
  CONFIG.DATA_Has_TLAST Not_Required \
  CONFIG.S_DATA_Has_TUSER Not_Required \
  CONFIG.M_DATA_Has_TUSER Not_Required \
] [get_bd_cells fir_compiler_1]
create_bd_cell -type ip -vlnv xilinx.com:ip:xlconcat:2.1 xlconcat_1
set_property -dict {CONFIG.IN0_WIDTH 12 CONFIG.IN1_WIDTH 4} [get_bd_cells xlconcat_1]
create_bd_cell -type ip -vlnv xilinx.com:ip:xlconstant:1.1 xlconstant_3
set_property -dict {CONFIG.CONST_WIDTH 4 CONFIG.CONST_VAL 0} [get_bd_cells xlconstant_3]
create_bd_cell -type ip -vlnv xilinx.com:ip:xlslice:1.0 xlslice_4
set_property -dict {CONFIG.DOUT_WIDTH 12 CONFIG.DIN_TO 12 CONFIG.DIN_FROM 23 CONFIG.DIN_WIDTH 24} [get_bd_cells xlslice_4]
create_bd_cell -type ip -vlnv xilinx.com:ip:xlslice:1.0 xlslice_5
set_property -dict {CONFIG.DOUT_WIDTH 14 CONFIG.DIN_TO 10 CONFIG.DIN_FROM 23 CONFIG.DIN_WIDTH 24} [get_bd_cells xlslice_5]
create_bd_cell -type ip -vlnv xilinx.com:ip:fir_compiler:7.2 fir_compiler_2
set_property -dict [list \
  CONFIG.CoefficientVector 5,0,12,22,0,-61,-96,0,256,551,681,551,256,0,-96,-61,0,22,12,0,5 \
  CONFIG.Coefficient_Sets 1 \
  CONFIG.Channel_Sequence Basic \
  CONFIG.Number_Channels 1 \
  CONFIG.Select_Pattern All \
  CONFIG.RateSpecification Input_Sample_Period \
  CONFIG.SamplePeriod 1 \
  CONFIG.Coefficient_Sign Signed \
  CONFIG.Quantization Integer_Coefficients \
  CONFIG.Coefficient_Width 11 \
  CONFIG.Coefficient_Fractional_Bits 0 \
  CONFIG.Coefficient_Structure Inferred \
  CONFIG.Data_Sign Unsigned \
  CONFIG.Data_Width 12 \
  CONFIG.Data_Fractional_Bits 0 \
  CONFIG.Output_Rounding_Mode Convergent_Rounding_to_Even \
  CONFIG.Output_Width 24 \
  CONFIG.Filter_Architecture Systolic_Multiply_Accumulate \
  CONFIG.ColumnConfig 11 \
  CONFIG.DATA_Has_TLAST Not_Required \
  CONFIG.S_DATA_Has_TUSER Not_Required \
  CONFIG.M_DATA_Has_TUSER Not_Required \
] [get_bd_cells fir_compiler_2]
create_bd_cell -type ip -vlnv xilinx.com:ip:xlconcat:2.1 xlconcat_2
set_property -dict {CONFIG.IN0_WIDTH 12 CONFIG.IN1_WIDTH 4} [get_bd_cells xlconcat_2]
create_bd_cell -type ip -vlnv xilinx.com:ip:xlconstant:1.1 xlconstant_5
set_property -dict {CONFIG.CONST_WIDTH 4 CONFIG.CONST_VAL 0} [get_bd_cells xlconstant_5]
create_bd_cell -type ip -vlnv xilinx.com:ip:xlslice:1.0 xlslice_6
set_property -dict {CONFIG.DOUT_WIDTH 12 CONFIG.DIN_TO 12 CONFIG.DIN_FROM 23 CONFIG.DIN_WIDTH 24} [get_bd_cells xlslice_6]
create_bd_cell -type ip -vlnv xilinx.com:ip:xlslice:1.0 xlslice_7
set_property -dict {CONFIG.DOUT_WIDTH 14 CONFIG.DIN_TO 10 CONFIG.DIN_FROM 23 CONFIG.DIN_WIDTH 24} [get_bd_cells xlslice_7]

# ---- hierarchy /test_control_block ----
current_bd_instance /test_control_block
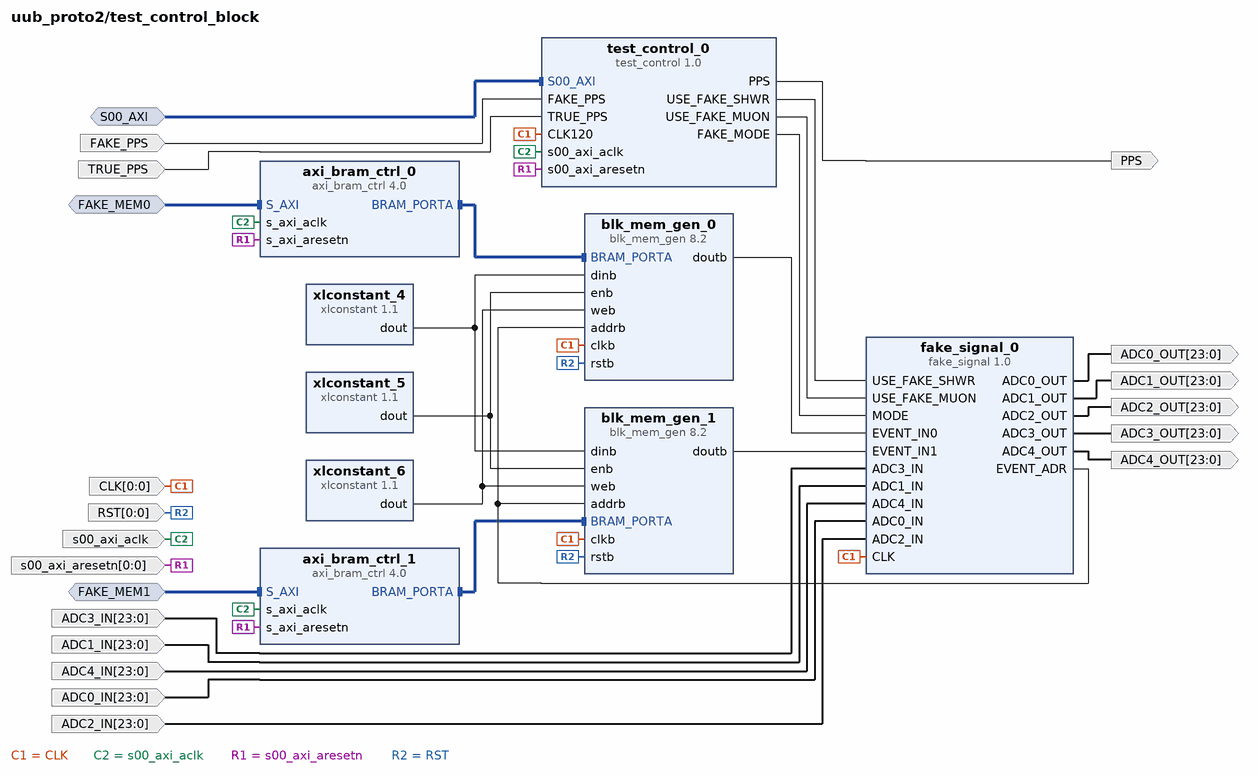
[diagram p7: block diagram inside /test_control_block]
create_bd_intf_pin -mode Slave -vlnv xilinx.com:interface:aximm_rtl:1.0 S00_AXI
create_bd_intf_pin -mode Slave -vlnv xilinx.com:interface:aximm_rtl:1.0 FAKE_MEM1
create_bd_intf_pin -mode Slave -vlnv xilinx.com:interface:aximm_rtl:1.0 FAKE_MEM0
create_bd_pin -dir I -from 0 -to 0 -type clk CLK
create_bd_pin -dir I -type clk s00_axi_aclk
create_bd_pin -dir I -from 0 -to 0 -type rst s00_axi_aresetn
create_bd_pin -dir O PPS
create_bd_pin -dir I -from 23 -to 0 ADC3_IN
create_bd_pin -dir I -from 23 -to 0 ADC1_IN
create_bd_pin -dir O -from 23 -to 0 ADC4_OUT
create_bd_pin -dir O -from 23 -to 0 ADC3_OUT
create_bd_pin -dir I FAKE_PPS
create_bd_pin -dir I -from 23 -to 0 ADC4_IN
create_bd_pin -dir I -from 23 -to 0 ADC0_IN
create_bd_pin -dir I -from 23 -to 0 ADC2_IN
create_bd_pin -dir O -from 23 -to 0 ADC2_OUT
create_bd_pin -dir O -from 23 -to 0 ADC0_OUT
create_bd_pin -dir O -from 23 -to 0 ADC1_OUT
create_bd_pin -dir I TRUE_PPS
create_bd_pin -dir I -from 0 -to 0 RST

create_bd_cell -type ip -vlnv xilinx.com:ip:axi_bram_ctrl:4.0 axi_bram_ctrl_0
set_property -dict {CONFIG.PROTOCOL AXI4 CONFIG.SINGLE_PORT_BRAM 1} [get_bd_cells axi_bram_ctrl_0]
create_bd_cell -type ip -vlnv user.org:user:test_control:1.0 test_control_0
create_bd_cell -type ip -vlnv xilinx.com:ip:blk_mem_gen:8.2 blk_mem_gen_0
set_property -dict [list \
  CONFIG.Memory_Type True_Dual_Port_RAM \
  CONFIG.Enable_B Use_ENB_Pin \
  CONFIG.Use_RSTB_Pin true \
  CONFIG.Port_B_Clock 100 \
  CONFIG.Port_B_Write_Rate 50 \
  CONFIG.Port_B_Enable_Rate 100 \
] [get_bd_cells blk_mem_gen_0]
create_bd_cell -type ip -vlnv xilinx.com:ip:blk_mem_gen:8.2 blk_mem_gen_1
set_property -dict [list \
  CONFIG.Memory_Type True_Dual_Port_RAM \
  CONFIG.Enable_B Use_ENB_Pin \
  CONFIG.Use_RSTB_Pin true \
  CONFIG.Port_B_Clock 100 \
  CONFIG.Port_B_Write_Rate 50 \
  CONFIG.Port_B_Enable_Rate 100 \
] [get_bd_cells blk_mem_gen_1]
create_bd_cell -type ip -vlnv xilinx.com:ip:xlconstant:1.1 xlconstant_4
set_property -dict {CONFIG.CONST_WIDTH 32 CONFIG.CONST_VAL 0} [get_bd_cells xlconstant_4]
create_bd_cell -type ip -vlnv xilinx.com:ip:axi_bram_ctrl:4.0 axi_bram_ctrl_1
set_property -dict {CONFIG.PROTOCOL AXI4 CONFIG.SINGLE_PORT_BRAM 1} [get_bd_cells axi_bram_ctrl_1]
create_bd_cell -type ip -vlnv xilinx.com:ip:xlconstant:1.1 xlconstant_5
set_property -dict {CONFIG.CONST_WIDTH 1 CONFIG.CONST_VAL 1} [get_bd_cells xlconstant_5]
create_bd_cell -type ip -vlnv xilinx.com:ip:xlconstant:1.1 xlconstant_6
set_property -dict {CONFIG.CONST_WIDTH 4 CONFIG.CONST_VAL 0} [get_bd_cells xlconstant_6]
create_bd_cell -type ip -vlnv user.org:user:fake_signal:1.0 fake_signal_0

# ---- hierarchy /fake_rd_block ----
current_bd_instance /fake_rd_block
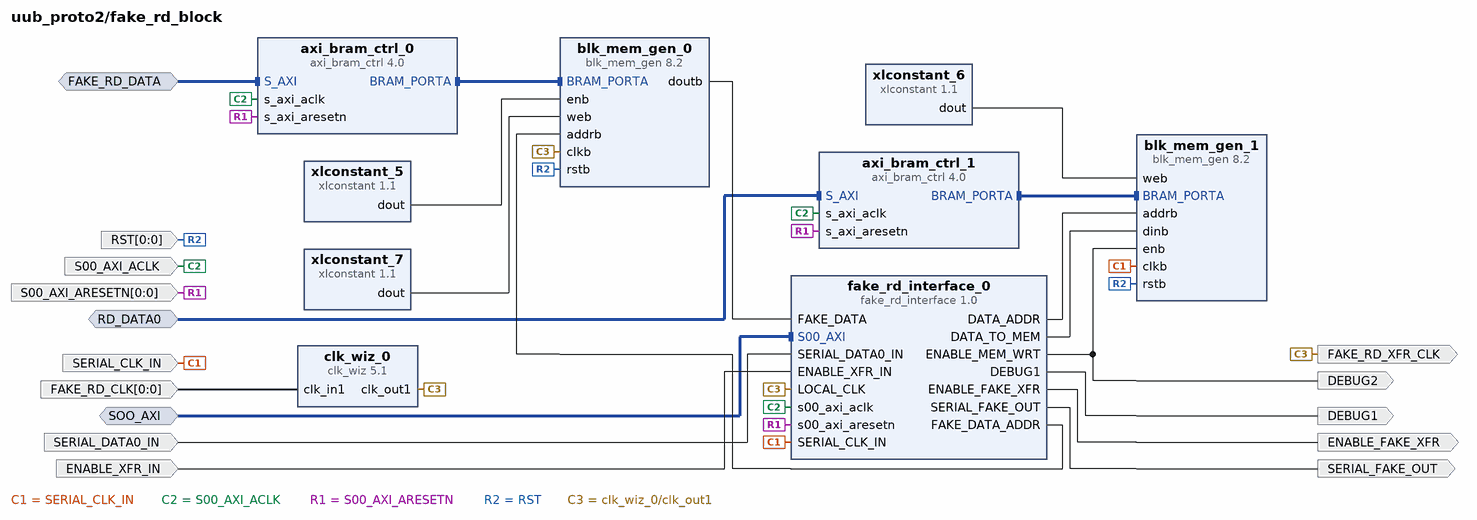
[diagram p8: block diagram inside /fake_rd_block]
create_bd_intf_pin -mode Slave -vlnv xilinx.com:interface:aximm_rtl:1.0 SOO_AXI
create_bd_intf_pin -mode Slave -vlnv xilinx.com:interface:aximm_rtl:1.0 FAKE_RD_DATA
create_bd_intf_pin -mode Slave -vlnv xilinx.com:interface:aximm_rtl:1.0 RD_DATA0
create_bd_pin -dir I SERIAL_DATA0_IN
create_bd_pin -dir I SERIAL_CLK_IN
create_bd_pin -dir I ENABLE_XFR_IN
create_bd_pin -dir I S00_AXI_ACLK
create_bd_pin -dir I -from 0 -to 0 S00_AXI_ARESETN
create_bd_pin -dir O ENABLE_FAKE_XFR
create_bd_pin -dir O SERIAL_FAKE_OUT
create_bd_pin -dir I -from 0 -to 0 RST
create_bd_pin -dir O DEBUG1
create_bd_pin -dir O DEBUG2
create_bd_pin -dir O FAKE_RD_XFR_CLK
create_bd_pin -dir I -from 0 -to 0 FAKE_RD_CLK

create_bd_cell -type ip -vlnv xilinx.com:ip:axi_bram_ctrl:4.0 axi_bram_ctrl_0
set_property -dict {CONFIG.PROTOCOL AXI4 CONFIG.SINGLE_PORT_BRAM 1} [get_bd_cells axi_bram_ctrl_0]
create_bd_cell -type ip -vlnv xilinx.com:ip:axi_bram_ctrl:4.0 axi_bram_ctrl_1
set_property -dict {CONFIG.SINGLE_PORT_BRAM 1} [get_bd_cells axi_bram_ctrl_1]
create_bd_cell -type ip -vlnv xilinx.com:ip:blk_mem_gen:8.2 blk_mem_gen_0
set_property -dict [list \
  CONFIG.Memory_Type True_Dual_Port_RAM \
  CONFIG.Enable_B Use_ENB_Pin \
  CONFIG.Use_RSTB_Pin true \
  CONFIG.Port_B_Clock 100 \
  CONFIG.Port_B_Write_Rate 50 \
  CONFIG.Port_B_Enable_Rate 100 \
] [get_bd_cells blk_mem_gen_0]
create_bd_cell -type ip -vlnv xilinx.com:ip:blk_mem_gen:8.2 blk_mem_gen_1
set_property -dict [list \
  CONFIG.Memory_Type True_Dual_Port_RAM \
  CONFIG.Enable_B Use_ENB_Pin \
  CONFIG.Use_RSTB_Pin true \
  CONFIG.Port_B_Clock 100 \
  CONFIG.Port_B_Write_Rate 50 \
  CONFIG.Port_B_Enable_Rate 100 \
] [get_bd_cells blk_mem_gen_1]
create_bd_cell -type ip -vlnv xilinx.com:ip:xlconstant:1.1 xlconstant_6
set_property -dict {CONFIG.CONST_WIDTH 4 CONFIG.CONST_VAL 15} [get_bd_cells xlconstant_6]
create_bd_cell -type ip -vlnv xilinx.com:ip:xlconstant:1.1 xlconstant_5
set_property -dict {CONFIG.CONST_WIDTH 1 CONFIG.CONST_VAL 1} [get_bd_cells xlconstant_5]
create_bd_cell -type ip -vlnv xilinx.com:ip:xlconstant:1.1 xlconstant_7
set_property -dict {CONFIG.CONST_WIDTH 4 CONFIG.CONST_VAL 0} [get_bd_cells xlconstant_7]
create_bd_cell -type ip -vlnv xilinx.com:ip:clk_wiz:5.1 clk_wiz_0
set_property -dict [list \
  CONFIG.PRIMITIVE PLL \
  CONFIG.USE_PHASE_ALIGNMENT false \
  CONFIG.SECONDARY_SOURCE Single_ended_clock_capable_pin \
  CONFIG.CLKOUT1_REQUESTED_OUT_FREQ 30 \
  CONFIG.CLKOUT1_REQUESTED_PHASE 0.00 \
  CONFIG.PRIM_SOURCE Single_ended_clock_capable_pin \
  CONFIG.CLKOUT1_DRIVES BUFG \
  CONFIG.CLKOUT2_DRIVES BUFG \
  CONFIG.CLKOUT3_DRIVES BUFG \
  CONFIG.CLKOUT4_DRIVES BUFG \
  CONFIG.CLKOUT5_DRIVES BUFG \
  CONFIG.CLKOUT6_DRIVES BUFG \
  CONFIG.CLKOUT7_DRIVES BUFG \
  CONFIG.USE_LOCKED false \
  CONFIG.USE_RESET false \
  CONFIG.MMCM_DIVCLK_DIVIDE 4 \
  CONFIG.MMCM_CLKFBOUT_MULT_F 27 \
  CONFIG.MMCM_COMPENSATION ZHOLD \
  CONFIG.MMCM_CLKOUT0_DIVIDE_F 27 \
  CONFIG.CLKOUT1_JITTER 305.524 \
  CONFIG.CLKOUT1_PHASE_ERROR 251.823 \
] [get_bd_cells clk_wiz_0]
create_bd_cell -type ip -vlnv auger.org:auger:fake_rd_interface:1.0 fake_rd_interface_0

# ---- connections ----

current_bd_instance /zync_block
connect_bd_intf_net [get_bd_intf_pins axi_cdma_0/M_AXI] [get_bd_intf_pins axi_interconnect_1/S00_AXI]
connect_bd_intf_net [get_bd_intf_pins axi_cdma_0/M_AXI_SG] [get_bd_intf_pins axi_interconnect_1/S01_AXI]
connect_bd_intf_net [get_bd_intf_pins axi_interconnect_0/M00_AXI] [get_bd_intf_pins axi_cdma_0/S_AXI_LITE]
connect_bd_intf_net [get_bd_intf_pins processing_system7_0/M_AXI_GP0] [get_bd_intf_pins axi_interconnect_0/S00_AXI]
connect_bd_intf_net [get_bd_intf_pins axi_cdma_1/M_AXI] [get_bd_intf_pins axi_interconnect_2/S00_AXI]
connect_bd_intf_net [get_bd_intf_pins axi_cdma_1/M_AXI_SG] [get_bd_intf_pins axi_interconnect_2/S01_AXI]
connect_bd_intf_net [get_bd_intf_pins axi_interconnect_0/M14_AXI] [get_bd_intf_pins axi_cdma_1/S_AXI_LITE]
connect_bd_intf_net [get_bd_intf_pins axi_interconnect_2/M02_AXI] [get_bd_intf_pins processing_system7_0/S_AXI_HP1]
connect_bd_intf_net [get_bd_intf_pins axi_interconnect_1/M05_AXI] [get_bd_intf_pins processing_system7_0/S_AXI_HP0]
connect_bd_intf_net [get_bd_intf_pins DDR] [get_bd_intf_pins processing_system7_0/DDR]
connect_bd_intf_net [get_bd_intf_pins FIXED_IO] [get_bd_intf_pins processing_system7_0/FIXED_IO]
connect_bd_intf_net [get_bd_intf_pins M01_AXI] [get_bd_intf_pins axi_interconnect_0/M01_AXI]
connect_bd_intf_net [get_bd_intf_pins MUON_MEM0] [get_bd_intf_pins axi_interconnect_2/M00_AXI]
connect_bd_intf_net [get_bd_intf_pins M02_AXI] [get_bd_intf_pins axi_interconnect_0/M02_AXI]
connect_bd_intf_net [get_bd_intf_pins SHWR_MEM0] [get_bd_intf_pins axi_interconnect_1/M00_AXI]
connect_bd_intf_net [get_bd_intf_pins M03_AXI] [get_bd_intf_pins axi_interconnect_0/M03_AXI]
connect_bd_intf_net [get_bd_intf_pins SHWR_MEM1] [get_bd_intf_pins axi_interconnect_1/M01_AXI]
connect_bd_intf_net [get_bd_intf_pins M04_AXI] [get_bd_intf_pins axi_interconnect_0/M04_AXI]
connect_bd_intf_net [get_bd_intf_pins SHWR_MEM2] [get_bd_intf_pins axi_interconnect_1/M02_AXI]
connect_bd_intf_net [get_bd_intf_pins M05_AXI] [get_bd_intf_pins axi_interconnect_0/M05_AXI]
connect_bd_intf_net [get_bd_intf_pins SHWR_MEM3] [get_bd_intf_pins axi_interconnect_1/M03_AXI]
connect_bd_intf_net [get_bd_intf_pins M06_AXI] [get_bd_intf_pins axi_interconnect_0/M06_AXI]
connect_bd_intf_net [get_bd_intf_pins SHWR_MEM4] [get_bd_intf_pins axi_interconnect_1/M04_AXI]
connect_bd_intf_net [get_bd_intf_pins MUON_MEM1] [get_bd_intf_pins axi_interconnect_2/M01_AXI]
connect_bd_intf_net [get_bd_intf_pins MUON_MEM0P] [get_bd_intf_pins axi_interconnect_0/M07_AXI]
connect_bd_intf_net [get_bd_intf_pins MUON_MEM1P] [get_bd_intf_pins axi_interconnect_0/M08_AXI]
connect_bd_intf_net [get_bd_intf_pins SHWR_MEM0P] [get_bd_intf_pins axi_interconnect_0/M09_AXI]
connect_bd_intf_net [get_bd_intf_pins SHWR_MEM1P] [get_bd_intf_pins axi_interconnect_0/M10_AXI]
connect_bd_intf_net [get_bd_intf_pins SHWR_MEM2P] [get_bd_intf_pins axi_interconnect_0/M11_AXI]
connect_bd_intf_net [get_bd_intf_pins SHWR_MEM3P] [get_bd_intf_pins axi_interconnect_0/M12_AXI]
connect_bd_intf_net [get_bd_intf_pins SHWR_MEM4P] [get_bd_intf_pins axi_interconnect_0/M13_AXI]
connect_bd_intf_net [get_bd_intf_pins MUON_INTR_IFC] [get_bd_intf_pins axi_interconnect_0/M15_AXI]
connect_bd_intf_net [get_bd_intf_pins AMIGA_UART_IFC] [get_bd_intf_pins axi_interconnect_0/M16_AXI]
connect_bd_intf_net [get_bd_intf_pins FAKE_MEM0] [get_bd_intf_pins axi_interconnect_0/M17_AXI]
connect_bd_intf_net [get_bd_intf_pins FAKE_MEM1] [get_bd_intf_pins axi_interconnect_0/M18_AXI]
connect_bd_intf_net [get_bd_intf_pins RD_MEM0P] [get_bd_intf_pins axi_interconnect_0/M19_AXI]
connect_bd_intf_net [get_bd_intf_pins RD_MEM1P] [get_bd_intf_pins axi_interconnect_0/M20_AXI]
connect_bd_intf_net [get_bd_intf_pins RD_IFC] [get_bd_intf_pins axi_interconnect_0/M21_AXI]
connect_bd_net [get_bd_pins proc_sys_reset_0/peripheral_reset] [get_bd_pins peripheral_reset]
connect_bd_net [get_bd_pins processing_system7_0/FCLK_CLK0] \
  [get_bd_pins FCLK_CLK0] [get_bd_pins axi_cdma_0/m_axi_aclk] [get_bd_pins axi_cdma_0/s_axi_lite_aclk] \
  [get_bd_pins axi_cdma_1/m_axi_aclk] [get_bd_pins axi_cdma_1/s_axi_lite_aclk] \
  [get_bd_pins processing_system7_0/M_AXI_GP0_ACLK] [get_bd_pins processing_system7_0/S_AXI_HP0_ACLK] \
  [get_bd_pins processing_system7_0/S_AXI_HP1_ACLK] [get_bd_pins proc_sys_reset_0/slowest_sync_clk] \
  [get_bd_pins axi_interconnect_1/ACLK] [get_bd_pins axi_interconnect_1/S00_ACLK] [get_bd_pins axi_interconnect_1/S01_ACLK] \
  [get_bd_pins axi_interconnect_1/M00_ACLK] [get_bd_pins axi_interconnect_1/M01_ACLK] \
  [get_bd_pins axi_interconnect_1/M02_ACLK] [get_bd_pins axi_interconnect_1/M03_ACLK] \
  [get_bd_pins axi_interconnect_1/M04_ACLK] [get_bd_pins axi_interconnect_1/M05_ACLK] [get_bd_pins axi_interconnect_0/ACLK] \
  [get_bd_pins axi_interconnect_0/S00_ACLK] [get_bd_pins axi_interconnect_0/M00_ACLK] \
  [get_bd_pins axi_interconnect_0/M01_ACLK] [get_bd_pins axi_interconnect_0/M02_ACLK] \
  [get_bd_pins axi_interconnect_0/M03_ACLK] [get_bd_pins axi_interconnect_0/M04_ACLK] \
  [get_bd_pins axi_interconnect_0/M05_ACLK] [get_bd_pins axi_interconnect_0/M06_ACLK] \
  [get_bd_pins axi_interconnect_0/M07_ACLK] [get_bd_pins axi_interconnect_0/M08_ACLK] \
  [get_bd_pins axi_interconnect_0/M09_ACLK] [get_bd_pins axi_interconnect_0/M10_ACLK] \
  [get_bd_pins axi_interconnect_0/M11_ACLK] [get_bd_pins axi_interconnect_0/M12_ACLK] \
  [get_bd_pins axi_interconnect_0/M13_ACLK] [get_bd_pins axi_interconnect_2/M02_ACLK] [get_bd_pins axi_interconnect_2/ACLK] \
  [get_bd_pins axi_interconnect_2/S00_ACLK] [get_bd_pins axi_interconnect_2/M00_ACLK] \
  [get_bd_pins axi_interconnect_2/M01_ACLK] [get_bd_pins axi_interconnect_2/S01_ACLK] \
  [get_bd_pins axi_interconnect_0/M14_ACLK] [get_bd_pins axi_interconnect_0/M15_ACLK] \
  [get_bd_pins axi_interconnect_0/M16_ACLK] [get_bd_pins axi_interconnect_0/M17_ACLK] \
  [get_bd_pins axi_interconnect_0/M18_ACLK] [get_bd_pins axi_interconnect_0/M19_ACLK] \
  [get_bd_pins axi_interconnect_0/M20_ACLK] [get_bd_pins axi_interconnect_0/M21_ACLK]
connect_bd_net [get_bd_pins processing_system7_0/FCLK_RESET0_N] \
  [get_bd_pins proc_sys_reset_0/ext_reset_in] [get_bd_pins proc_sys_reset_0/aux_reset_in] \
  [get_bd_pins proc_sys_reset_1/ext_reset_in] [get_bd_pins proc_sys_reset_1/aux_reset_in]
connect_bd_net -net processing_system7_0_UART0_RTSN [get_bd_pins RADIO_CTS] [get_bd_pins RADIO_RTS]
connect_bd_net -net trigger_memory_0_IRQ [get_bd_pins SHWR_INT] [get_bd_pins xlconcat_0/In1]
connect_bd_net [get_bd_pins axi_cdma_0/cdma_introut] [get_bd_pins xlconcat_0/In0]
connect_bd_net [get_bd_pins GPS_UART_INT] [get_bd_pins xlconcat_0/In2]
connect_bd_net [get_bd_pins MUON_INT] [get_bd_pins xlconcat_0/In4]
connect_bd_net [get_bd_pins axi_cdma_1/cdma_introut] [get_bd_pins xlconcat_0/In3]
connect_bd_net [get_bd_pins AMIGA_UART_INT] [get_bd_pins xlconcat_0/In5]
connect_bd_net [get_bd_pins proc_sys_reset_0/interconnect_aresetn] \
  [get_bd_pins axi_interconnect_0/M16_ARESETN] [get_bd_pins axi_interconnect_0/M15_ARESETN] \
  [get_bd_pins axi_interconnect_0/M14_ARESETN] [get_bd_pins axi_interconnect_0/M13_ARESETN] \
  [get_bd_pins axi_interconnect_0/M12_ARESETN] [get_bd_pins axi_interconnect_0/M11_ARESETN] \
  [get_bd_pins axi_interconnect_0/M10_ARESETN] [get_bd_pins axi_interconnect_0/M09_ARESETN] \
  [get_bd_pins axi_interconnect_0/M08_ARESETN] [get_bd_pins axi_interconnect_0/M07_ARESETN] \
  [get_bd_pins axi_interconnect_0/M06_ARESETN] [get_bd_pins axi_interconnect_0/M05_ARESETN] \
  [get_bd_pins axi_interconnect_0/M04_ARESETN] [get_bd_pins axi_interconnect_0/M03_ARESETN] \
  [get_bd_pins axi_interconnect_0/M02_ARESETN] [get_bd_pins axi_interconnect_0/M01_ARESETN] \
  [get_bd_pins axi_interconnect_0/M00_ARESETN] [get_bd_pins axi_interconnect_0/S00_ARESETN] \
  [get_bd_pins axi_interconnect_0/ARESETN] [get_bd_pins axi_interconnect_1/M05_ARESETN] \
  [get_bd_pins axi_interconnect_1/M04_ARESETN] [get_bd_pins axi_interconnect_1/M03_ARESETN] \
  [get_bd_pins axi_interconnect_1/M02_ARESETN] [get_bd_pins axi_interconnect_1/M01_ARESETN] \
  [get_bd_pins axi_interconnect_1/M00_ARESETN] [get_bd_pins axi_interconnect_1/S01_ARESETN] \
  [get_bd_pins axi_interconnect_1/S00_ARESETN] [get_bd_pins axi_interconnect_1/ARESETN] \
  [get_bd_pins axi_interconnect_2/M02_ARESETN] [get_bd_pins axi_interconnect_2/S01_ARESETN] \
  [get_bd_pins axi_interconnect_2/M01_ARESETN] [get_bd_pins axi_interconnect_2/M00_ARESETN] \
  [get_bd_pins axi_interconnect_2/S00_ARESETN] [get_bd_pins axi_interconnect_2/ARESETN] \
  [get_bd_pins axi_interconnect_0/M17_ARESETN] [get_bd_pins axi_interconnect_0/M18_ARESETN] \
  [get_bd_pins axi_interconnect_0/M19_ARESETN] [get_bd_pins axi_interconnect_0/M20_ARESETN] \
  [get_bd_pins axi_interconnect_0/M21_ARESETN]
connect_bd_net [get_bd_pins proc_sys_reset_0/peripheral_aresetn] \
  [get_bd_pins peripheral_aresetn] [get_bd_pins axi_cdma_1/s_axi_lite_aresetn] [get_bd_pins axi_cdma_0/s_axi_lite_aresetn]
connect_bd_net [get_bd_pins xlconcat_0/dout] [get_bd_pins processing_system7_0/IRQ_F2P]
connect_bd_net [get_bd_pins processing_system7_0/FCLK_CLK1] [get_bd_pins RD_XFR_CLK] [get_bd_pins proc_sys_reset_1/slowest_sync_clk]
connect_bd_net [get_bd_pins proc_sys_reset_1/peripheral_reset] [get_bd_pins RD_RST]
